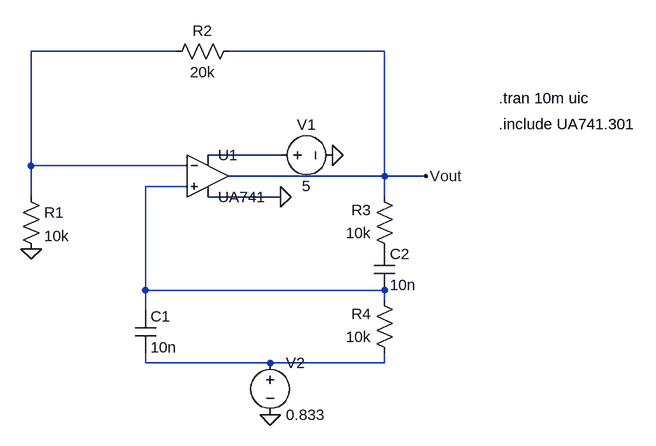
[diagram p0: schematic winebridge.asc]
winebridge.asc, the LTspice schematic file:
Version 4
SHEET 1 1112 704
WIRE 400 128 176 128
WIRE 720 128 480 128
WIRE 560 288 448 288
WIRE 176 304 176 128
WIRE 416 304 176 304
WIRE 720 320 720 128
WIRE 720 320 480 320
WIRE 784 320 720 320
WIRE 416 336 352 336
WIRE 176 352 176 304
WIRE 560 352 448 352
WIRE 720 352 720 320
WIRE 352 496 352 336
WIRE 720 496 352 496
WIRE 720 512 720 496
WIRE 352 528 352 496
WIRE 352 608 352 592
WIRE 544 608 352 608
WIRE 720 608 720 592
WIRE 720 608 544 608
FLAG 784 320 Vout
FLAG 640 288 0
FLAG 560 352 0
FLAG 176 432 0
FLAG 544 688 0
SYMBOL res 160 336 R0
SYMATTR InstName R1
SYMATTR Value 10k
SYMBOL res 496 112 R90
WINDOW 0 0 56 VBottom 2
WINDOW 3 32 56 VTop 2
SYMATTR InstName R2
SYMATTR Value 20k
SYMBOL res 736 448 R180
WINDOW 0 36 76 Left 2
WINDOW 3 36 40 Left 2
SYMATTR InstName R3
SYMATTR Value 10k
SYMBOL res 736 608 R180
WINDOW 0 36 76 Left 2
WINDOW 3 36 40 Left 2
SYMATTR InstName R4
SYMATTR Value 10k
SYMBOL cap 336 528 R0
SYMATTR InstName C1
SYMATTR Value 10n
SYMBOL cap 704 432 R0
SYMATTR InstName C2
SYMATTR Value 10n
SYMBOL voltage 544 288 R270
WINDOW 0 32 56 VTop 2
WINDOW 3 -32 56 VBottom 2
SYMATTR InstName V1
SYMATTR Value 5
SYMBOL voltage 544 592 R0
SYMATTR InstName V2
SYMATTR Value 0.833
SYMBOL OpAmps/opamp2 448 256 R0
SYMATTR InstName U1
SYMATTR Value UA741
TEXT 896 200 Left 2 !.tran 10m uic
TEXT 896 240 Left 2 !.include UA741.301

The netlist it stands for:
* winebridge.asc
R1 N001 0 10k
R2 Vout N001 20k
R3 P001 Vout 10k
R4 N004 N003 10k
C1 N003 N004 10n
C2 P001 N003 10n
V1 N002 0 5
V2 N004 0 0.833
XU1 N003 N001 N002 0 Vout UA741  ; pins In+ In- V+ V- OUT
.tran 10m uic
.include UA741.301
.backanno
.end